# Altium schematic sheet BAT.SchDoc: FHGR_A3_landscape
size A3; Date: 18.07.2017; DrawnBy: G.P. Catregn; Organization: HTW Chur; Address1: Pulvermühlestrasse 57; Address2: 7004 Chur; Address3: Switzerland; DocumentNumber: 1; Revision: V1.0; SheetNumber: 3; SheetTotal: 3; DocumentName: HTW Template
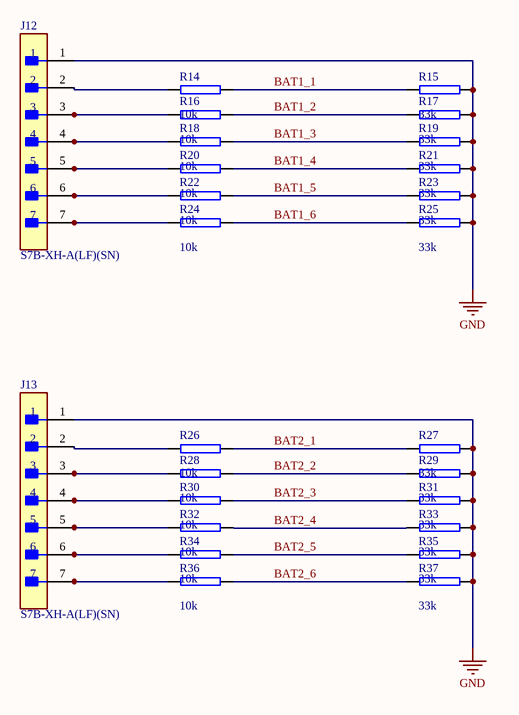
[diagram p0: BAT.SchDoc]

## Parts
J12  S7B-XH-A(LF)(SN)  [FP-S7B-XH-A_LF_SN-MFG]
J13  S7B-XH-A(LF)(SN)  [FP-S7B-XH-A_LF_SN-MFG]
R14  value 10k  [0805]  (hidden comment: R 10K 0805)
R15  value 33k  [0805]  (hidden comment: R 33K 0805)
R16  value 10k  [0805]  (hidden comment: R 10K 0805)
R17  value 33k  [0805]  (hidden comment: R 33K 0805)
R18  value 10k  [0805]  (hidden comment: R 10K 0805)
R19  value 33k  [0805]  (hidden comment: R 33K 0805)
R20  value 10k  [0805]  (hidden comment: R 10K 0805)
R21  value 33k  [0805]  (hidden comment: R 33K 0805)
R22  value 10k  [0805]  (hidden comment: R 10K 0805)
R23  value 33k  [0805]  (hidden comment: R 33K 0805)
R24  value 10k  [0805]  (hidden comment: R 10K 0805)
R25  value 33k  [0805]  (hidden comment: R 33K 0805)
R26  value 10k  [0805]  (hidden comment: R 10K 0805)
R27  value 33k  [0805]  (hidden comment: R 33K 0805)
R28  value 10k  [0805]  (hidden comment: R 10K 0805)
R29  value 33k  [0805]  (hidden comment: R 33K 0805)
R30  value 10k  [0805]  (hidden comment: R 10K 0805)
R31  value 33k  [0805]  (hidden comment: R 33K 0805)
R32  value 10k  [0805]  (hidden comment: R 10K 0805)
R33  value 33k  [0805]  (hidden comment: R 33K 0805)
R34  value 10k  [0805]  (hidden comment: R 10K 0805)
R35  value 33k  [0805]  (hidden comment: R 33K 0805)
R36  value 10k  [0805]  (hidden comment: R 10K 0805)
R37  value 33k  [0805]  (hidden comment: R 33K 0805)

## Nets
GND: J12.1 J13.1 R15.2 R17.2 R19.2 R21.2 R23.2 R25.2 R27.2 R29.2 R31.2 R33.2 R35.2 R37.2
BAT1_1: R14.2 R15.1
BAT1_2: R16.2 R17.1
BAT1_3: R18.2 R19.1
BAT1_4: R20.2 R21.1
BAT1_5: R22.2 R23.1
BAT1_6: R24.2 R25.1
BAT2_1: R26.2 R27.1
BAT2_2: R28.2 R29.1
BAT2_3: R30.2 R31.1
BAT2_4: R32.2 R33.1
BAT2_5: R34.2 R35.1
BAT2_6: R36.2 R37.1
NetJ12_2: J12.2 R14.1
NetJ12_3: J12.3 R16.1
NetJ12_4: J12.4 R18.1
NetJ12_5: J12.5 R20.1
NetJ12_6: J12.6 R22.1
NetJ12_7: J12.7 R24.1
NetJ13_2: J13.2 R26.1
NetJ13_3: J13.3 R28.1
NetJ13_4: J13.4 R30.1
NetJ13_5: J13.5 R32.1
NetJ13_6: J13.6 R34.1
NetJ13_7: J13.7 R36.1

## Notes on the sheet
- Drawn by:
- Title:
- Date:
- Sheet
- of
- Size:
- Revision:
- A3
- File:

## Library data of the parts
J12 J13 = CMP-17439-000441-1: CONN HEADER R/A 7POS 2.5MM; Voltage Rating (AC): 250V; Contact Resistance: 10mR; Insulation Resistance: 1GR; Number of Positions: 7; Wire/Cable Gauge: 22AWG; Current Rating: 3A; Gender: Male; Flammability Rating: UL94 V-0; Packaging: Bulk; Color: Natural; Insulation Color: Natural; Lead Pitch: 2.5mm; Max Operating Temperature: 85°C; REACH SVHC: No SVHC; Contact Plating: Tin; Number of Rows: 1; Fastening Type: Detent; Voltage Rating: 250V; Pitch: 2.5mm; Contact Material: Brass; Lead Free: Lead Free; Contact Type: Male Pin; Mount: Through Hole; Min Operating Temperature: -25°C; Insulation Material: Nylon; Contact Finish - Mating: TIN; Termination: Solder; Contact Shape: Square; Connector Type: Header; Number of Contacts: 7; Orientation: Right Angle; Series: XH; Package Quantity: 250
R14 R16 R18 R20 R22 R24 R26 R28 R30 R32 R34 R36 = R_10k_0805: Tolerance: 1%; Power Dissipation: 125mW; Part ID: R_10k_0805; Price 10pcs (CHF): 0.021; Supplier 1: Digi-Key; Supplier Part Number 1: 311-10.0KCRCT-ND
R15 R17 R19 R21 R23 R25 R27 R29 R31 R33 R35 R37 = R_33k_0805: Tolerance: 1%; Power Dissipation: 125mW; Part ID: R_33k_0805; Price 10pcs (CHF): 0.042; Supplier 1: Digi-Key; Supplier Part Number 1: 311-33.0KCRCT-ND